# EasyEDA schematic Nakuja Remix 4.json
TITLE: Sheet_1; REV: 1.0; Date: 2022-04-21; Sheet: 1/1; Drawn By: Rodney Osodo; Company: Your Company
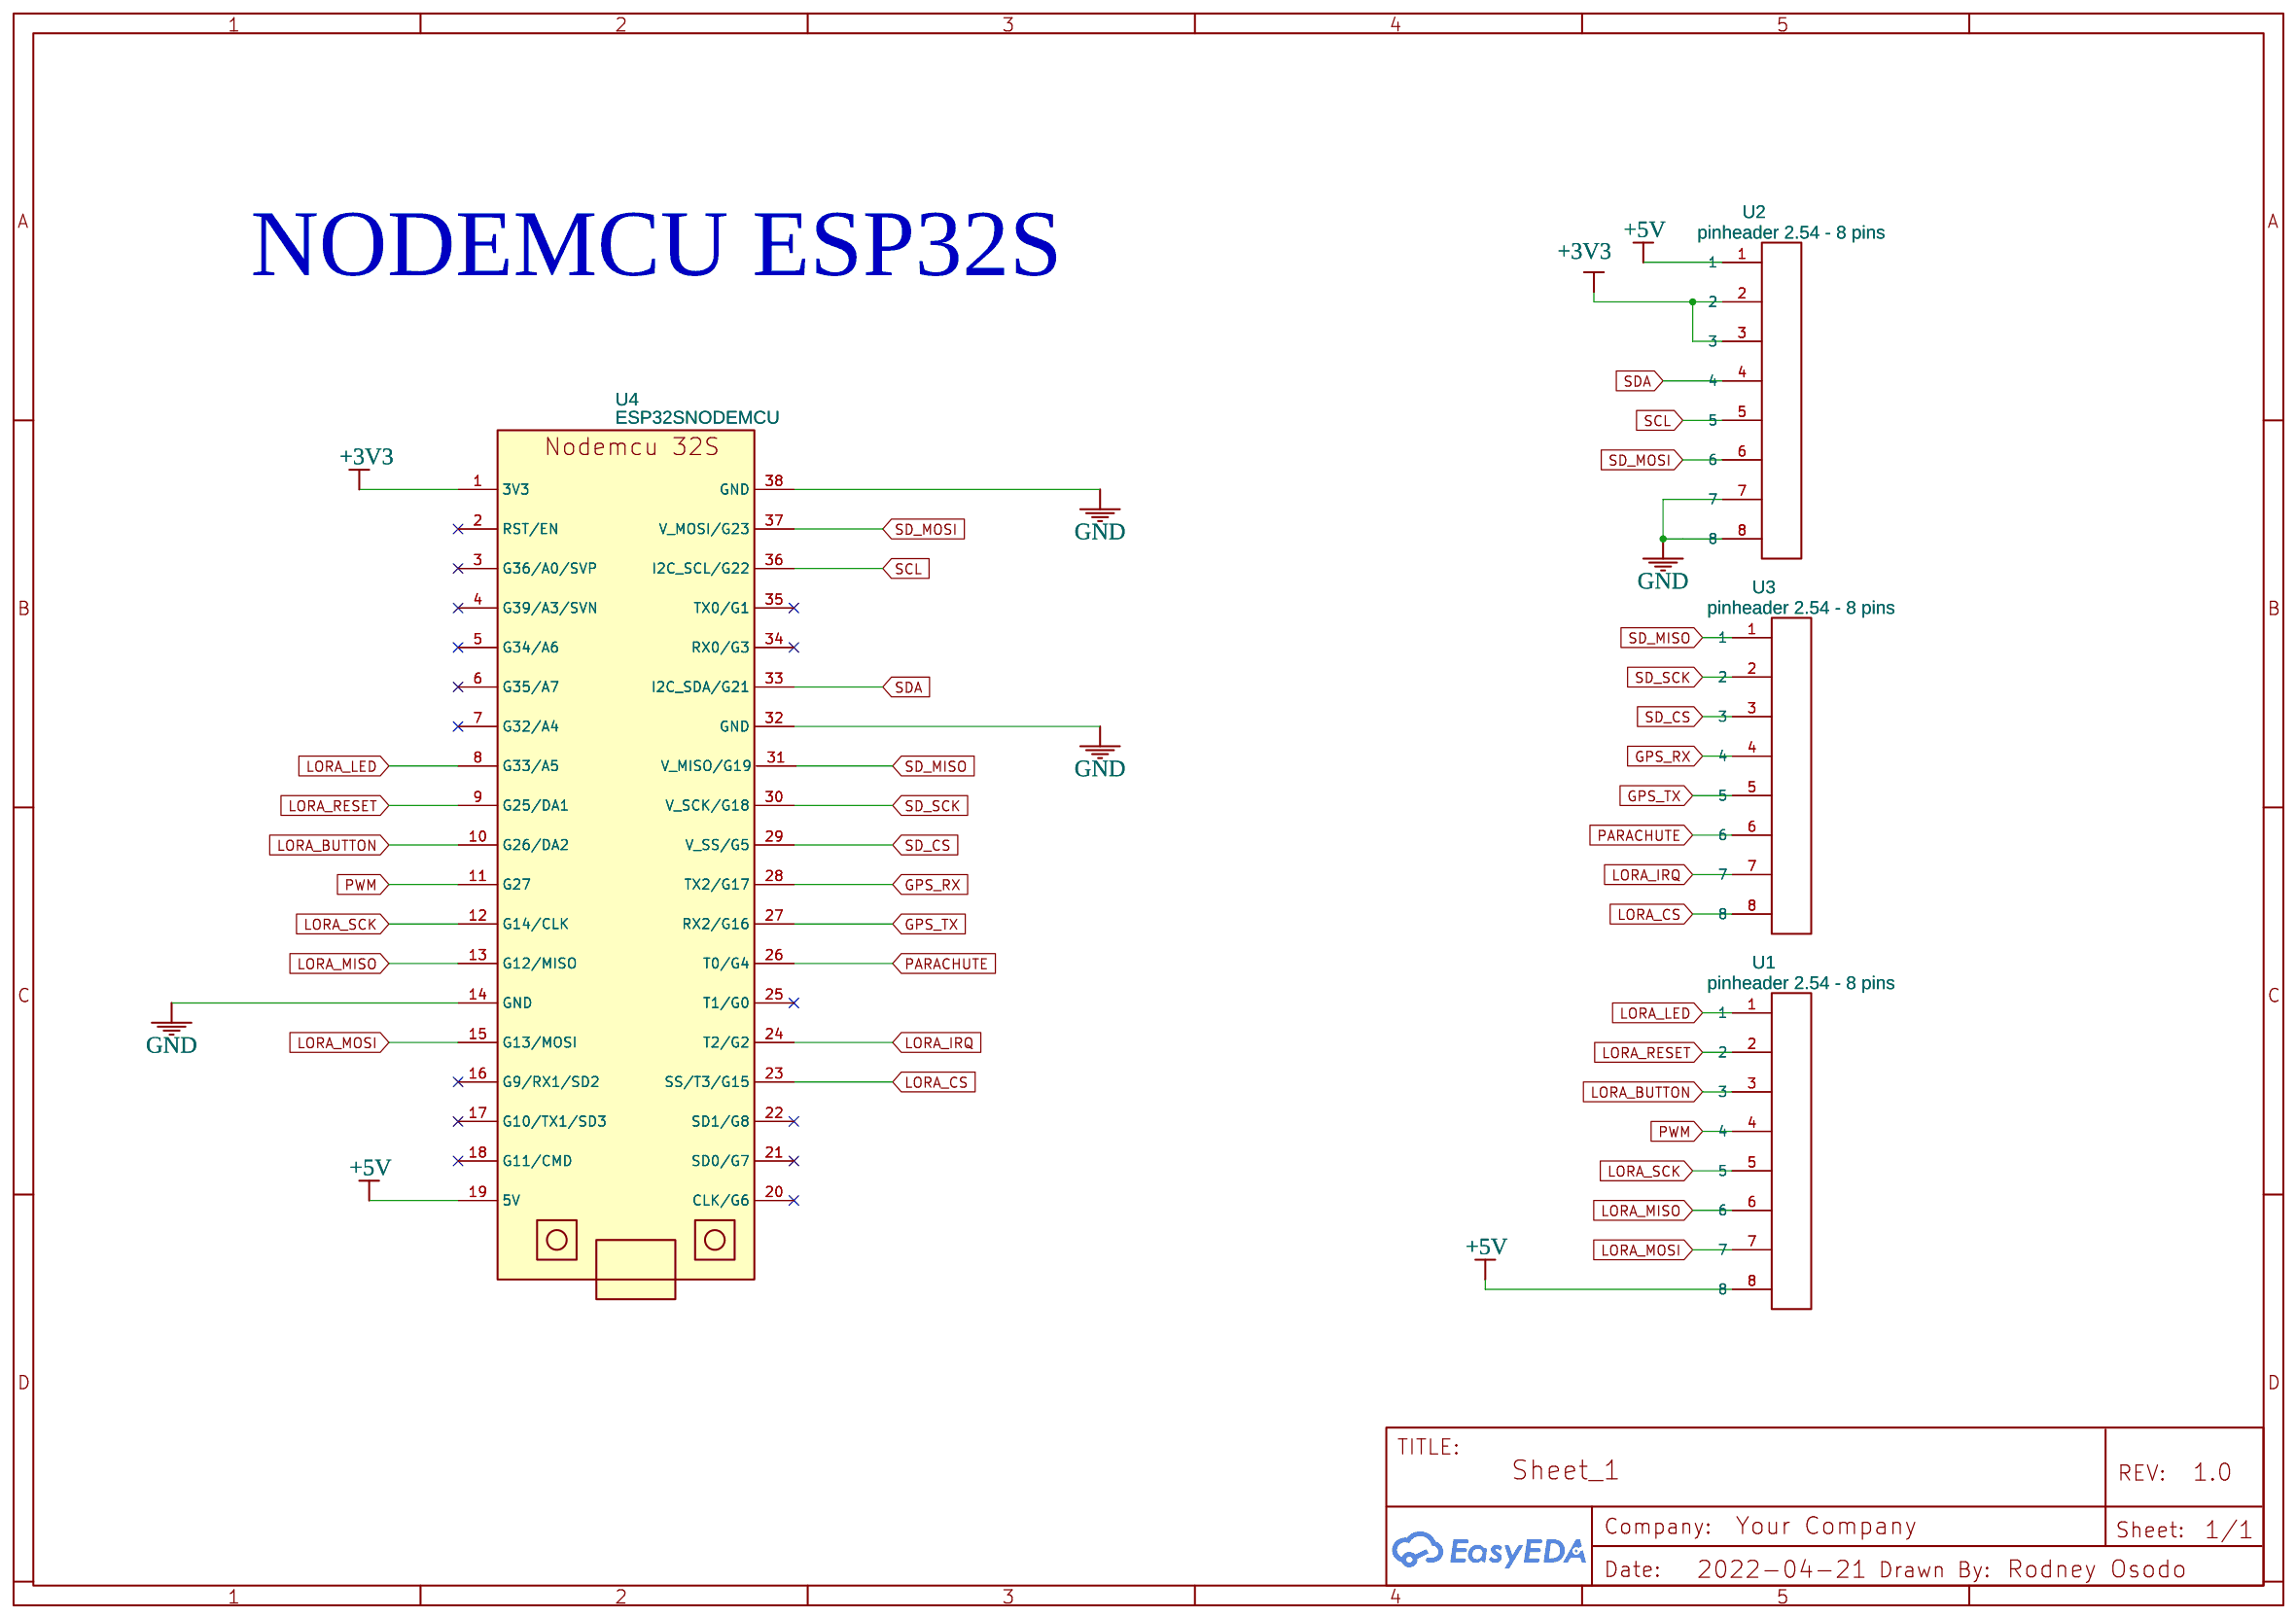
[diagram p0: schematic sheet]

## Parts
U1  pinheader 2.54 - 8 pins  [PINHEADER 2.54 - 8 PINS]
U2  pinheader 2.54 - 8 pins  [PINHEADER 2.54 - 8 PINS]
U3  pinheader 2.54 - 8 pins  [PINHEADER 2.54 - 8 PINS]
U4  ESP32SNODEMCU  [NODEMCU-ESP32S]

## Library data of the parts
U1-U3 = pinheader 2.54 - 8 pins: Contributor: pramodsreelakam
U4 = ESP32SNODEMCU: Manufacturer Part: Nodemcu esp32; Contributor: samlewis2406

## Nets
+3V3: U2.2 U2.3 U4.1(3V3)
+5V: U1.8 U2.1 U4.19(5V)
GND: U2.7 U2.8 U4.14(GND) U4.32(GND) U4.38(GND)
GPS_RX: U3.4 U4.28(TX2/G17)
GPS_TX: U3.5 U4.27(RX2/G16)
LORA_BUTTON: U1.3 U4.10(G26/DA2)
LORA_CS: U3.8 U4.23(SS/T3/G15)
LORA_IRQ: U3.7 U4.24(T2/G2)
LORA_LED: U1.1 U4.8(G33/A5)
LORA_MISO: U1.6 U4.13(G12/MISO)
LORA_MOSI: U1.7 U4.15(G13/MOSI)
LORA_RESET: U1.2 U4.9(G25/DA1)
LORA_SCK: U1.5 U4.12(G14/CLK)
PARACHUTE: U3.6 U4.26(T0/G4)
PWM: U1.4 U4.11(G27)
SCL: U2.5 U4.36(I2C SCL/G22)
SD_CS: U3.3 U4.29(V_SS/G5)
SD_MISO: U3.1 U4.31(V_MISO/G19)
SD_MOSI: U2.6 U4.37(V_MOSI/G23)
SD_SCK: U3.2 U4.30(V_SCK/G18)
SDA: U2.4 U4.33(I2C SDA/G21)

Not connected (* = marked no-connect by the designer): U4 2(RST/EN)* 3(G36/A0/SVP)* 4(G39/A3/SVN)* 5(G34/A6)* 6(G35/A7)* 7(G32/A4)* 16(G9/RX1/SD2)* 17(G10/TX1/SD3)* 18(G11/CMD)* 20(CLK/G6)* 21(SD0/G7)* 22(SD1/G8)* 25(T1/G0)* 34(RX0/G3)* 35(TX0/G1)*

## Notes on the sheet
- NODEMCU ESP32S
